# Altium schematic sheet Sheet1.SCHDOC
size 296 x 209 mm; SheetNumber: 1; SheetTotal: 1; DocumentName: Sheet1.SCHDOC
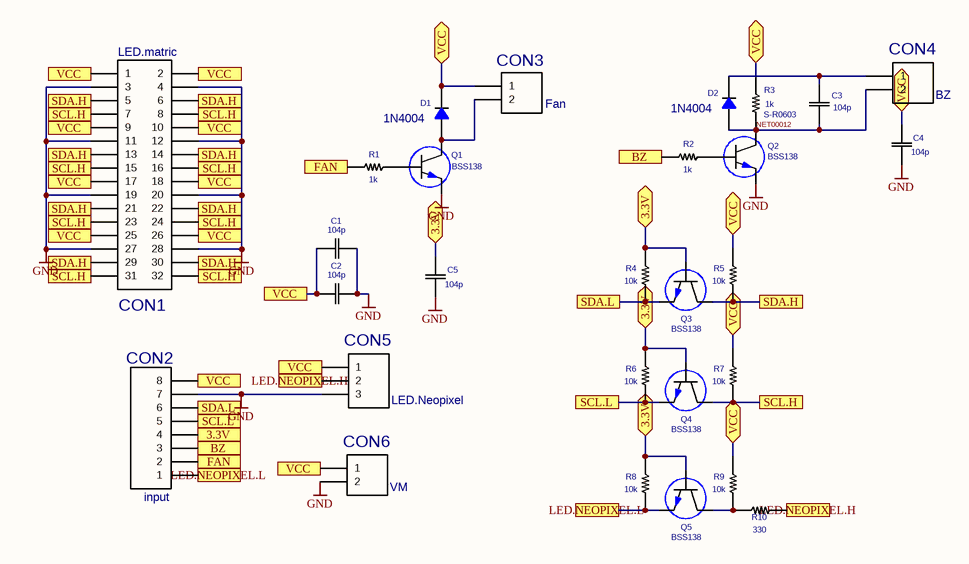
[diagram p0: Sheet1.SCHDOC]

## Parts
C1  value 104p  [CC0603]  (hidden comment: S-104P)
C2  value 104p  [CC0603]  (hidden comment: S-104P)
C3  value 104p  [CC0603]  (hidden comment: S-104P)
C4  value 104p  [CC0603]  (hidden comment: S-104P)
C5  value 104p  [CC0603]  (hidden comment: S-104P)
CON1  value LED.matric  [HDR2X16H]  (hidden comment: HEADER_16X2H)
CON2  value input  [HDR1X8H]  (hidden comment: HEADER_8H)
CON3  value Fan  [HDR1X2H]  (hidden comment: HEADER_2H)
CON4  value BZ  [HDR1X2H]  (hidden comment: HEADER_2H)
CON5  value LED.Neopixel  [HDR1X3H]  (hidden comment: HEADER_3H)
CON6  value VM  [HDR1X2H]  (hidden comment: HEADER_2H)
D1  value 1N4004  [D2010]  (hidden comment: S-1N4004)
D2  value 1N4004  [D2010]  (hidden comment: S-1N4004)
Q1  value BSS138  [SOT-23]  (hidden comment: S-2SC2412)
Q2  value BSS138  [SOT-23]  (hidden comment: S-2SC2412)
Q3  value BSS138  [SOT-23]  (hidden comment: S-2SC2412)
Q4  value BSS138  [SOT-23]  (hidden comment: S-2SC2412)
Q5  value BSS138  [SOT-23]  (hidden comment: S-2SC2412)
R1  value 1k  [R0603]  (hidden comment: S-R0603)
R2  value 1k  [R0603]  (hidden comment: S-R0603)
R3  S-R0603  value 1k  [R0603]
R4  value 10k  [R0603]  (hidden comment: S-R0603)
R5  value 10k  [R0603]  (hidden comment: S-R0603)
R6  value 10k  [R0603]  (hidden comment: S-R0603)
R7  value 10k  [R0603]  (hidden comment: S-R0603)
R8  value 10k  [R0603]  (hidden comment: S-R0603)
R9  value 10k  [R0603]  (hidden comment: S-R0603)
R10  value 330  [R0603]  (hidden comment: S-R0603)

## Ports
3.3V, BZ, FAN, LED.NEOPIXEL.H, LED.NEOPIXEL.L, SCL.H, SCL.L, SDA.H, SDA.L, VCC

## Nets
GND: C1.2 C2.2 C4.1 C5.1 CON1.3 CON1.4 CON1.11 CON1.12 CON1.19 CON1.20 CON1.27 CON1.28 CON2.7 CON5.3 CON6.2 Q1.3 Q2.3
3.3V: C5.2 CON2.4 Q3.1 Q4.1 Q5.1 R4.B R6.B R8.B ; port 3.3V
BZ: CON2.3 R2.A ; port BZ
FAN: CON2.2 R1.A ; port FAN
LED.NEOPIXEL.H: CON5.2 R10.A ; port LED.NEOPIXEL.H
LED.NEOPIXEL.L: CON2.1 Q5.3 R8.A ; port LED.NEOPIXEL.L
NET00012: C3.1 CON4.2 D2.2 Q2.2 R3.A
SCL.H: CON1.7 CON1.8 CON1.15 CON1.16 CON1.23 CON1.24 CON1.31 CON1.32 Q4.2 R7.A ; port SCL.H
SCL.L: CON2.5 Q4.3 R6.A ; port SCL.L
SDA.H: CON1.5 CON1.6 CON1.13 CON1.14 CON1.21 CON1.22 CON1.29 CON1.30 Q3.2 R5.A ; port SDA.H
SDA.L: CON2.6 Q3.3 R4.A ; port SDA.L
VCC: C1.1 C2.1 C3.2 C4.2 CON1.1 CON1.2 CON1.9 CON1.10 CON1.17 CON1.18 CON1.25 CON1.26 CON2.8 CON3.1 CON4.1 CON5.1 CON6.1 D1.1 D2.1 R3.B R5.B R7.B R9.B ; port VCC
NetCON3_2: CON3.2 D1.2 Q1.2
NetQ1_1: Q1.1 R1.B
NetQ2_1: Q2.1 R2.B
NetQ5_2: Q5.2 R9.A R10.B

## Library data of the parts
CON1 = HEADER_16X2H: LatestRevisionDate: 17-Jul-2002; LatestRevisionNote: Re-released for DXP Platform.; Publisher: Altium Limited
CON2 = HEADER_8H: LatestRevisionDate: 17-Jul-2002; LatestRevisionNote: Re-released for DXP Platform.; Publisher: Altium Limited
CON3 CON4 CON6 = HEADER_2H: LatestRevisionDate: 17-Jul-2002; LatestRevisionNote: Re-released for DXP Platform.; Publisher: Altium Limited
CON5 = HEADER_3H: LatestRevisionDate: 17-Jul-2002; LatestRevisionNote: Re-released for DXP Platform.; Publisher: Altium Limited